# EAGLE design bicyclelab-charger-3 (EAGLE 6.2)
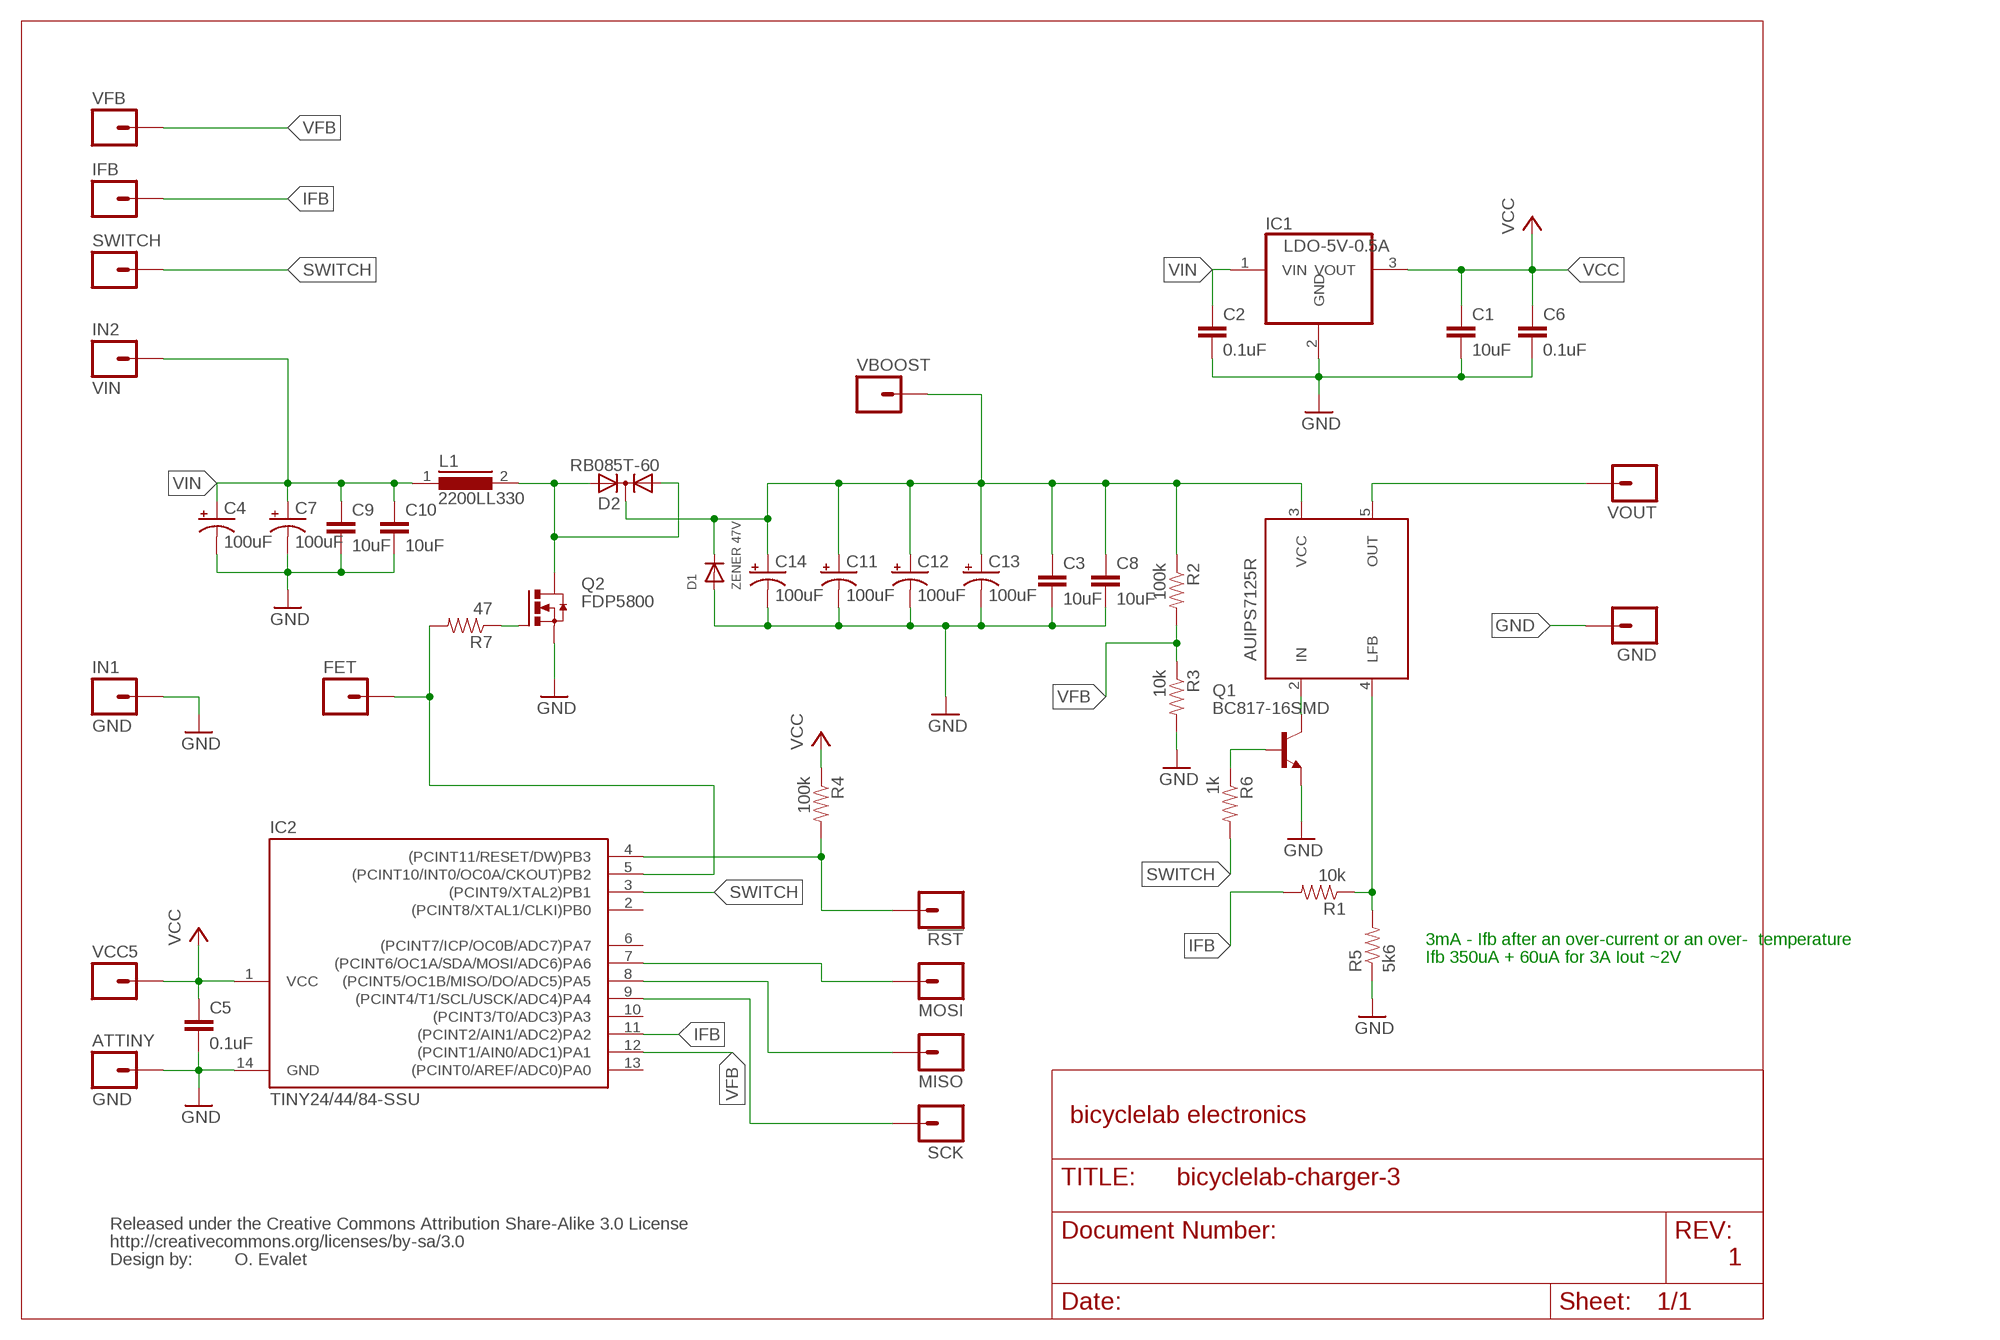
[diagram p0: schematic, sheet 1]

## Parts
!RST  M01SMDNS  [1X01NS]
ATTINY  GND  M01SMDNS  [1X01NS]
C1  10uF  CAP1210  [1210]
C2  0.1uF  CAP0805  [0805]
C3  10uF  CAP1210  [1210]
C4  100uF  CPOL-USD  [PANASONIC_D]
C5  0.1uF  CAP0805  [0805]
C6  0.1uF  CAP0805  [0805]
C7  100uF  CPOL-USD  [PANASONIC_D]
C8  10uF  CAP1210  [1210]
C9  10uF  CAP1210  [1210]
C10  10uF  CAP1210  [1210]
C11  100uF  CPOL-USD  [PANASONIC_D]
C12  100uF  CPOL-USD  [PANASONIC_D]
C13  100uF  CPOL-USD  [PANASONIC_D]
C14  100uF  CPOL-USD  [PANASONIC_D]
D1  ZENER 47V  DIODESOD-123  [SOD-123]
D2  RB085T-60  DIODE-2AC|CATO220H  [TO220AB]
FET  M01SMDNS  [1X01NS]
GND  M01SMDNS  [1X01NS]
IC1  LDO-5V-0.5A  [SOT223]
IC2  TINY24/44/84-SSU  [SOIC14]
IFB  M01SMDNS  [1X01NS]
IN1  GND  M01SMDNS  [1X01NS]
IN2  VIN  M01PTH  [1X01]
L1  2200LL330  2200LL  [2200LL]
MISO  M01SMDNS  [1X01NS]
MOSI  M01SMDNS  [1X01NS]
Q1  BC817-16SMD  [SOT23-BEC]
Q2  FDP5800  IRF3704  [TO220AH]
R1  10k  RESISTOR  [0805]
R2  100k  RESISTOR  [0805]
R3  10k  RESISTOR  [0805]
R4  100k  RESISTOR  [0805]
R5  5k6  RESISTOR  [0805]
R6  1k  RESISTOR  [0805]
R7  47  RESISTOR  [0805]
SCK  M01SMDNS  [1X01NS]
SWITCH  M01SMDNS  [1X01NS]
U$5  CREATIVE_COMMONS  [CREATIVE_COMMONS]
U$8  AUIPS7125R  [DPAK-5]
VBOOST  M01SMDNS  [1X01NS]
VCC5  M01PTH  [1X01]
VFB  M01SMDNS  [1X01NS]
VOUT  M01PTH  [1X01]

## Nets
GND: ATTINY.1 C1.2 C2.2 C3.2 C4.- C5.2 C6.2 C7.- C8.2 C9.2 C10.2 C11.- C12.- C13.- C14.- D1.A GND.1 IC1.2(GND) IC2.14(GND) IN1.1 Q1.E Q2.E(S) R3.2 R5.1
IFB: IC2.11((PCINT2/AIN1/ADC2)PA2) IFB.1 R1.2
N$1: FET.1 IC2.5((PCINT10/INT0/OC0A/CKOUT)PB2) R7.2
N$2: Q1.B R6.1
N$3: !RST.1 IC2.4((PCINT11/RESET/DW)PB3) R4.2
N$4: Q2.B(G) R7.1
N$5: IC2.7((PCINT6/OC1A/SDA/MOSI/ADC6)PA6) MOSI.1
N$6: IC2.8((PCINT5/OC1B/MISO/DO/ADC5)PA5) MISO.1
N$7: IC2.9((PCINT4/T1/SCL/USCK/ADC4)PA4) SCK.1
N$9: R1.1 R5.2 U$8.4(LFB)
N$10: Q1.C U$8.2(IN)
SWITCH: IC2.3((PCINT9/XTAL2)PB1) R6.2 SWITCH.1
VBOOST: C3.1 C8.1 C11.+ C12.+ C13.+ C14.+ D1.C D2.C R2.1 U$8.3(VCC) VBOOST.1
VCC: C1.1 C5.1 C6.1 IC1.3(VOUT) IC2.1(VCC) R4.1 VCC5.1
VFB: IC2.12((PCINT1/AIN0/ADC1)PA1) R2.2 R3.1 VFB.1
VFET: D2.A1 D2.A2 L1.2 Q2.C(D)
VIN: C2.1 C4.+ C7.+ C9.1 C10.1 IC1.1(VIN) IN2.1 L1.1
VOUT: U$8.5(OUT) VOUT.1
Unconnected: IC2.2((PCINT8/XTAL1/CLKI)PB0) IC2.6((PCINT7/ICP/OC0B/ADC7)PA7) IC2.10((PCINT3/T0/ADC3)PA3) IC2.13((PCINT0/AREF/ADC0)PA0) U$8.1(NC)

## Notes on the sheet
- 3mA - Ifb after an over-current or an over-  temperature
- Ifb 350uA + 60uA for 3A Iout ~2V
- bicyclelab electronics
- O. Evalet | 1

## Library data of the parts
!RST ATTINY FET GND IFB IN1 IN2 MISO MOSI SCK SWITCH VBOOST VCC5 VFB VOUT = SparkFun:M01: Header 1 Standard 1-pin 0.1" header. Use with straight break away headers (SKU : PRT-00116), right angle break away headers (PRT-00553), swiss pins (PRT-00743), machine pins (PRT-00117), and female headers (PRT-00115).
C1 C3 C8-C10 = bicyclelab:CAP: Capacitor Standard 0603 ceramic capacitor, and 0.1" leaded capacitor.
C2 C5 C6 = SparkFun:CAP: Capacitor Standard 0603 ceramic capacitor, and 0.1" leaded capacitor.
C4 C7 C11-C14 = adafruit:CPOL-US: POLARIZED CAPACITOR, American symbol
D1 = adafruit:DIODE: Diode SMADIODE - SMA Surface Mount Package 20V 1A Schottky Diode Digikey: 641-1014-6-ND DO-1N4148 - Through Hole Small Current Diode SOD-123 20V 1 A (.5mV Vf) Schottky Diode - Digikey: MBRX120TPMSCT-ND SOD-323 10V 570mA (.38mV Vf, 3ns) Schottky Diode - Digikey: ZLLS410CT-ND SOD-523 30V 30mA Schottky Diode (RB751S-40TE61) - Digikey: RB751S-40TE61CT-ND SOT23-R/W - SOT23 Package (R = Solder Paste/Reflow Ovens, W = Hand-Soldering) BAT54Film 40V 300mA - Digikey: 497-7162-1-ND
D2 = diode:DIODE-2AC|CA: Dual DIODE Anode-Cathode|Cathode-Anode
IC1 = bicyclelab:LDO-5V-0.5A: 500mA Low Dropout (LDO) Positive Regulator 3.3V, 5V; MODEL1: uA78M00; MODEL2: SPX2945M3
IC2 = 0-avr-7:TINY24/44/84
L1 = bicyclelab:2200LL: INDUCTOR
Q1 = transistor-npn:BC817*: NPN Transistor
Q2 = transistor-power:IRF3704: SMPS MOSFET HEXFET® Power MOSFET Source: http://www.irf.com/product-info/datasheets/data/irf3704.pdf
R1-R7 = SparkFun:RESISTOR: Resistor Basic schematic elements and footprints for 0603, 1206, and PTH 1/10th watt (small) resistors.
U$5 = SparkFun:CREATIVE_COMMONS
U$8 = bicyclelab:AUIPS7125R

## Net classes
0 default: width 0.203 mm
1 power: width 0.508 mm

## Board
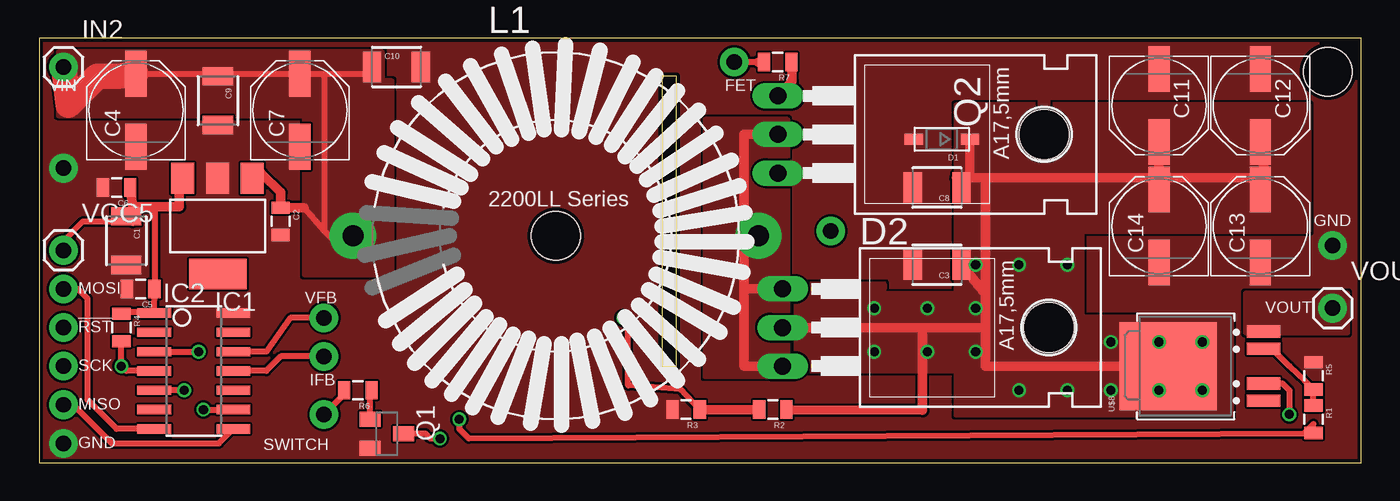
[diagram p1: board, top side]
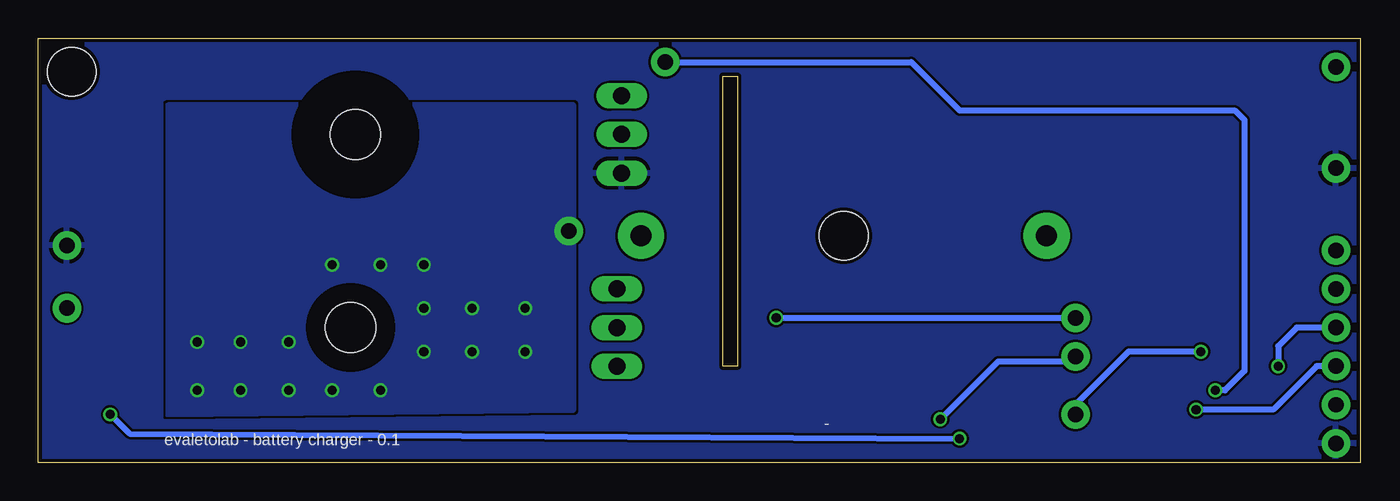
[diagram p2: board, bottom side, seen from below]

Size 86.98 x 27.93 mm. Coordinates in mm from the lower left corner, seen from the top.
Outline: 0,0 86.98,0 86.98,27.93 0,27.93 0,0
Outline: 41.91,6.35 41.91,25.4 40.96,25.4 40.96,6.35 41.91,6.35
Copper layers (1*16): Top 0.035mm / dielectric 1.5mm / Bottom 0.035mm
Design rules: minimum track width 6mil, minimum drill 12mil, track to track 6mil, track to pad 6mil, pad to pad 6mil, via to via 6mil, smd to smd 0mil, copper to edge 10mil, drill to drill 10mil, minimum pad ring 10mil, minimum via ring 6mil, stop-mask expansion 2mil, vias tented up to drill 100mil, thermal gap 10mil
Holes 3.2 mm at 33.97,14.92 84.77,25.72

### Footprints (pad centres in the part's own frame; a part is rotated, then mirrored left to right if it is on the bottom)
1X01NS = drill 1.016 pad 1.88: 1 0,0
1210 = smd 1.2 x 2: 1 -1.6,0; 2 1.6,0
0805 = smd 0.8 x 1.2: 1 -0.9,0; 2 0.9,0
PANASONIC_D = smd 3 x 1.4: + 2.4,0; - -2.4,0
SOD-123 = smd 1.2 x 0.7: A 1.85,0; C -1.85,0
TO220AB = drill 1.118 long: A1 -2.54,-6.35; A2 2.54,-6.35; C 0,-6.35 | hole 3.302: 0,11.176
SOT223 = smd 1.499 x 2.007: 1 -2.261,-3.15; 2 0.025,-3.15; 3 2.311,-3.15 | smd 3.81 x 2.007: 4 0,3.15
SOIC14 = smd 0.61 x 2.21: 1 -3.81,-2.603; 2 -2.54,-2.603; 3 -1.27,-2.603; 4 0,-2.603; 5 1.27,-2.603; 6 2.54,-2.603; 7 3.81,-2.603; 8 3.81,2.603; 9 2.54,2.603; 10 1.27,2.603; 11 0,2.603; 12 -1.27,2.603; 13 -2.54,2.603; 14 -3.81,2.603
1X01 = drill 1.016 pad 1.88: 1 0,0
2200LL = drill 1.372 pad 3.048: 1 -13.335,0; 2 13.335,0
SOT23-BEC = smd 1 x 1.4: B -0.95,-1.1; C 0,1.1; E 0.95,-1.1
TO220AH = drill 1.118 long: B -2.54,-6.35; C 0,-6.35; E 2.54,-6.35 | hole 3.302: 0,11.176
DPAK-5 = smd 0.8 x 2.2: 1 -2.28,-5.3; 2 -1.14,-5.3; 4 1.14,-5.3; 5 2.28,-5.3 | smd 5.8 x 6.4: 3 0,1

### Placement (x,y rotation side)
!RST  1.59,8.89 0 top
ATTINY  1.59,1.27 0 top
C1  5.71,14.61 270 top
C2  15.88,15.88 270 top
C3  59.05,13.02 180 top
C4  6.35,23.18 90 top
C5  6.67,11.43 180 top
C6  5.08,18.1 180 top
C7  17.14,23.18 90 top
C8  59.05,18.1 180 top
C9  11.75,23.81 270 top
C10  23.5,26.04 0 top
C11  73.66,23.5 270 top
C12  80.33,23.5 270 top
C13  80.33,15.56 90 top
C14  73.66,15.56 90 top
D1  59.37,21.27 180 top
D2  55.24,8.89 270 top
FET  45.72,26.35 0 top
GND  85.09,14.29 180 top
IC1  11.75,15.56 180 top
IC2  10.16,6.03 270 top
IFB  18.73,6.99 0 top
IN1  1.59,19.37 0 top
IN2  1.59,26.04 0 top
L1  33.97,14.92 0 top
MISO  1.59,3.81 0 top
MOSI  1.59,11.43 0 top
Q1  22.86,1.91 270 top
Q2  54.93,21.59 270 top
R1  83.82,2.86 270 top
R2  48.26,3.49 180 top
R3  42.55,3.49 180 top
R4  5.4,8.89 270 top
R5  83.82,5.71 270 top
R6  20.95,4.76 180 top
R7  48.58,26.35 180 top
SCK  1.59,6.35 0 top
SWITCH  18.73,3.17 0 top
U$5  22.23,-12.06 0 top  (outside the outline)
U$8  75.25,6.35 90 top
VBOOST  52.07,15.24 0 top
VCC5  1.59,13.97 0 top
VFB  18.73,9.53 0 top
VOUT  85.09,10.16 0 top

### Tracks (layer width: path | path; a pad name or v marks a point on that pad's centre or on a via)
GND
  pour Top (rank 4, no thermals): 0,27.94 87,27.94 87,0 0,0
  pour Bottom (rank 3): 0.32,0 86.68,0 86.68,27.62 0.32,27.62
IFB  (via drill 0.6)
  Top 0.406: R1.2 83.82,2.54 83.19,1.91 28.26,1.59 27.62,2.22 v27.62,2.86 | IFB.1 15.88,6.99 14.92,6.03 IC2.11
  Bottom 0.406: v27.62,2.86 23.81,6.67 19.05,6.67 IFB.1
N$1  (via drill 0.6)
  Top 0.406: 47.31,26.35 FET.1 | v9.53,4.76 IC2.5
  Top 0.61: 47.31,26.35 R7.2
  Bottom 0.406: FET.1 29.53,26.35 26.35,23.18 8.26,23.18 7.62,22.54 7.62,6.03 8.89,4.76 v9.53,4.76
N$2
  Top 0.406: Q1.B 21.76,4.67 R6.1
N$3  (via drill 0.6)
  Top 0.406: R4.2 v5.4,6.35 5.71,6.03 IC2.4
  Bottom 0.406: !RST.1 4.18,8.89 5.4,7.67 v5.4,6.35
N$4
  Top 0.61: Q2.B 49.53,25.08 49.53,26.3 R7.1
N$5
  Top 0.406: MOSI.1 2.54,11.43 3.17,10.79 3.17,4.13 5.08,2.22 IC2.7
N$6
  Top 0.406: MISO.1 2.22,3.81 4.76,1.27 11.81,1.27 IC2.8
N$7  (via drill 0.6)
  Top 0.406: v10.79,3.49 IC2.9
  Bottom 0.406: SCK.1 2.86,6.35 5.71,3.49 v10.79,3.49
N$9
  Top 0.406: U$8.4 81.18,7.4 82.23,6.35 83.24,5.4 R5.2 R1.1
N$10  (via drill 0.6)
  Top 0.406: v26.35,1.59 25.72,1.59 25.4,1.91 Q1.C | U$8.2 81.78,5.21 82.23,4.76 v82.23,3.17
  Bottom 0.406: v82.23,3.17 80.96,1.91 v26.35,1.59
SWITCH  (via drill 0.6)
  Top 0.406: IC2.3 v10.48,7.3 | 19.05,2.85 SWITCH.1 20.05,4.5 R6.2
  Bottom 0.406: v10.48,7.3 15.24,7.3 18.73,3.81 SWITCH.1
VBOOST  (via drill 0.6)
  Top 0.61: D2.C 58.1,8.89 | 58.1,8.89 62.23,8.89 | 62.23,8.89 62.23,11.11 | 62.23,11.11 62.23,18.73 | 73.66,18.73 80.64,18.73 | 80.64,18.73 C13.+ | C12.+ 80.64,18.73 | C11.+ 73.66,18.73 | C14.+ 73.66,18.73 | U$8.3 62.23,6.35 62.23,8.89 | 73.66,18.73 62.23,18.73 | R2.1 58.1,3.44 58.1,8.89 | C3.1 62.23,11.11 | 62.23,18.73 61.22,18.73 | 60.33,18.73 61.22,18.73 | 61.22,18.73 D1.C
  other vias: 76.52,4.76 76.52,7.94 73.66,7.94 73.66,4.76 70.48,4.76 70.48,7.94 64.45,13.02 67.63,4.76 64.45,4.76 61.59,7.3 61.59,10.16 58.42,10.16 58.42,7.3 54.93,10.16 61.59,13.02 67.63,13.02 54.93,7.3
  pour Top (no thermals): 83.5,15.24 83.5,23.5 60.33,23.5 60.33,3.17 78.42,3.17 78.42,9.53 68.58,9.53 68.58,15.24
  pour Top (no thermals): 60.33,6.03 49.85,6.03 49.85,11.75 55.56,11.75 55.56,11.43 55.24,11.43 55.24,11.11 60.33,11.11
  pour Bottom (rank 2, no thermals): 78.42,3.17 51.75,3.49 51.75,23.5 78.42,23.5
VCC
  Top 0.406: 7.52,9.88 C5.1 7.57,11.7 7.62,12.06 7.62,16.51 7.3,16.83 | 7.52,9.88 IC2.1 | 7.52,9.88 5.49,9.88 R4.1 | VCC5.1 1.59,14.61 2.86,15.88 5.38,15.88 C1.1
  Top 0.61: 6.13,16.83 7.3,16.83 9.21,16.83 9.21,18.48 IC1.3 | 6.13,16.83 C6.1 | 6.13,16.83 6.13,15.88 C1.1
VFB  (via drill 0.6)
  Top 0.406: VFB.1 16.51,9.53 14.92,7.3 IC2.12 | R3.1 42.17,4.82 38.73,5.08 38.73,9.21 v38.42,9.53
  Top 0.61: R3.1 R2.2
  Bottom 0.406: v38.42,9.53 VFB.1
VFET
  Top 0.61: L1.2 46.35,14.92 | 46.35,14.92 46.35,21.59 Q2.C | 46.35,11.43 46.35,14.92 | D2.A1 46.35,11.43 | 46.35,11.43 46.35,6.35 D2.A2
  pour Top (rank 2, no thermals): 43.81,5.71 49.21,5.71 49.21,22.54 43.81,22.54
VIN
  Top 0.406: C4.+ 10.79,25.58 | 10.79,25.58 C7.+ | C9.1 10.79,25.58 | C7.+ 21.45,25.58 21.59,25.72 C10.1 | C7.+ 18.55,25.58 18.73,25.4 18.73,15.24 | 18.73,15.24 19.68,14.29 L1.1 | 17.41,16.77 18.73,15.24
  Top 0.61: 17.41,16.77 C2.1 15.88,17.78 14.61,19.05 14.35,19.05 IC1.1
  Top 1.676: IN2.1 1.91,23.5 3.81,25.4 5.22,25.4 C4.+
  pour Top (rank 2, no thermals): 23.18,12.38 23.18,25.08 22.54,25.08 22.54,26.99 1.27,26.99 1.27,22.86 17.46,22.86 17.46,12.38
VOUT
  pour Top (rank 2, no thermals): 79.38,8.57 86.04,8.57 86.04,11.11 79.38,11.11

### Text on the board
tPlace: VIN | FET | GND | MOSI | VFB | VOUT | !RST | SCK | IFB | MISO | SWITCH | GND
bPlace: - | evaletolab - battery charger - 0.1
tValues: 100W BATTERY CHARGER - SOURCE 20V 5A | O.Evalet - Version 0.1